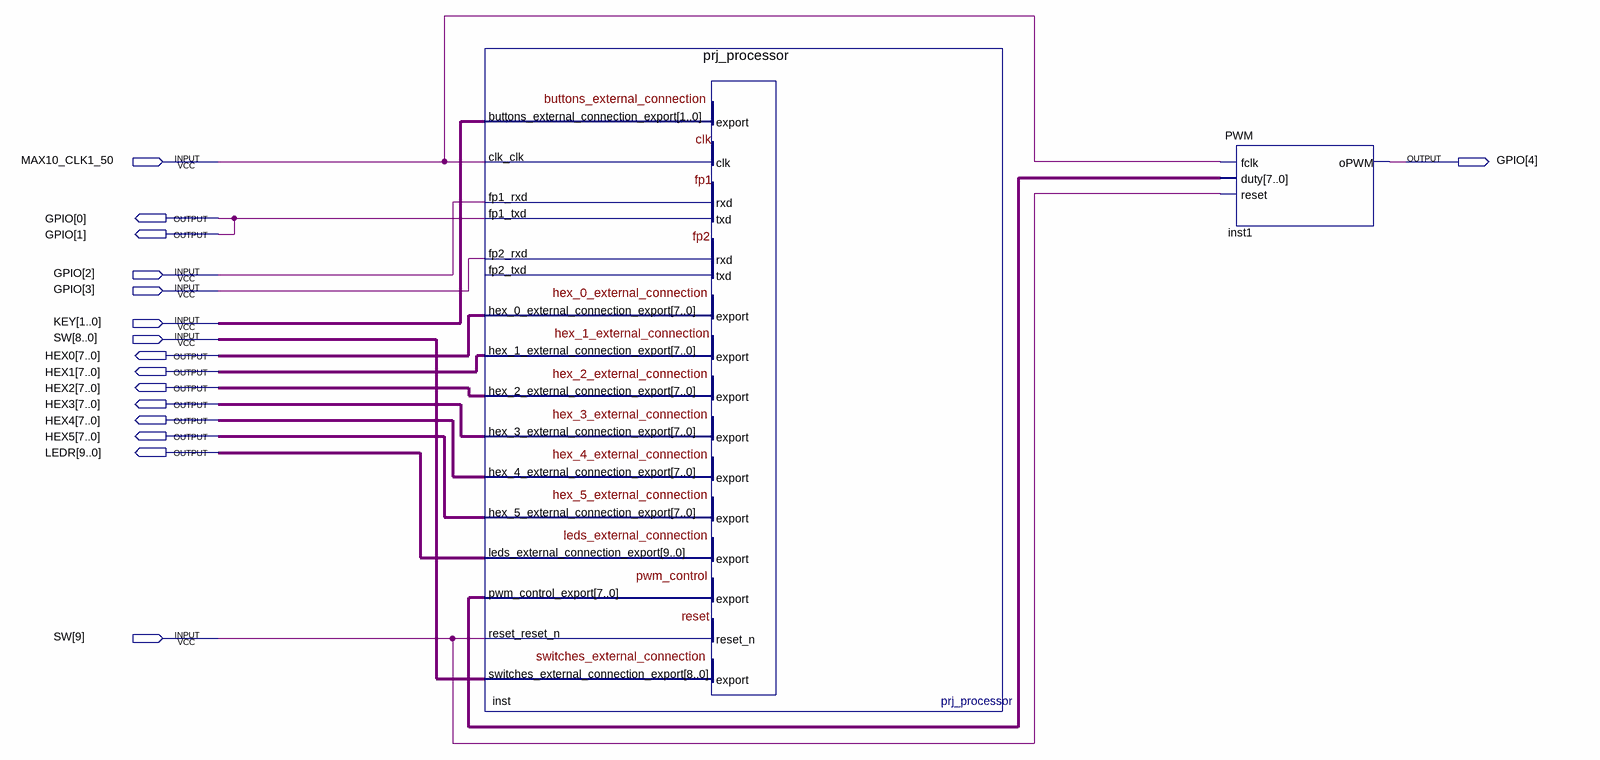
[diagram p0: schematic sheet]
// Quartus schematic project_bdf.bdf as structural Verilog: 2 symbols, 16 pins
module project_bdf (
  input  MAX10_CLK1_50,
  inout  [4:0] GPIO,
  input  [1:0] KEY,
  input  [9:0] SW,
  output [7:0] HEX0,
  output [7:0] HEX1,
  output [7:0] HEX2,
  output [7:0] HEX3,
  output [7:0] HEX4,
  output [7:0] HEX5,
  output [9:0] LEDR
);

  wire [7:0] inst_pwm_control_export;

  prj_processor inst (
    .buttons_external_connection_export(KEY), .clk_clk(MAX10_CLK1_50), .fp1_rxd(GPIO[2]), .fp2_rxd(GPIO[3]),
    .reset_reset_n(SW[9]), .switches_external_connection_export(SW[8:0]), .fp1_txd(GPIO[1]),
    .hex_0_external_connection_export(HEX0), .hex_1_external_connection_export(HEX1),
    .hex_2_external_connection_export(HEX2), .hex_3_external_connection_export(HEX3),
    .hex_4_external_connection_export(HEX4), .hex_5_external_connection_export(HEX5),
    .leds_external_connection_export(LEDR), .pwm_control_export(inst_pwm_control_export));  // open: fp2_txd
  PWM inst1 (.fclk(MAX10_CLK1_50), .duty(inst_pwm_control_export), .reset(SW[9]), .oPWM(GPIO[4]));

  assign GPIO[0] = GPIO[1];
endmodule
